# EAGLE design BabyDriver (EAGLE 6.4)
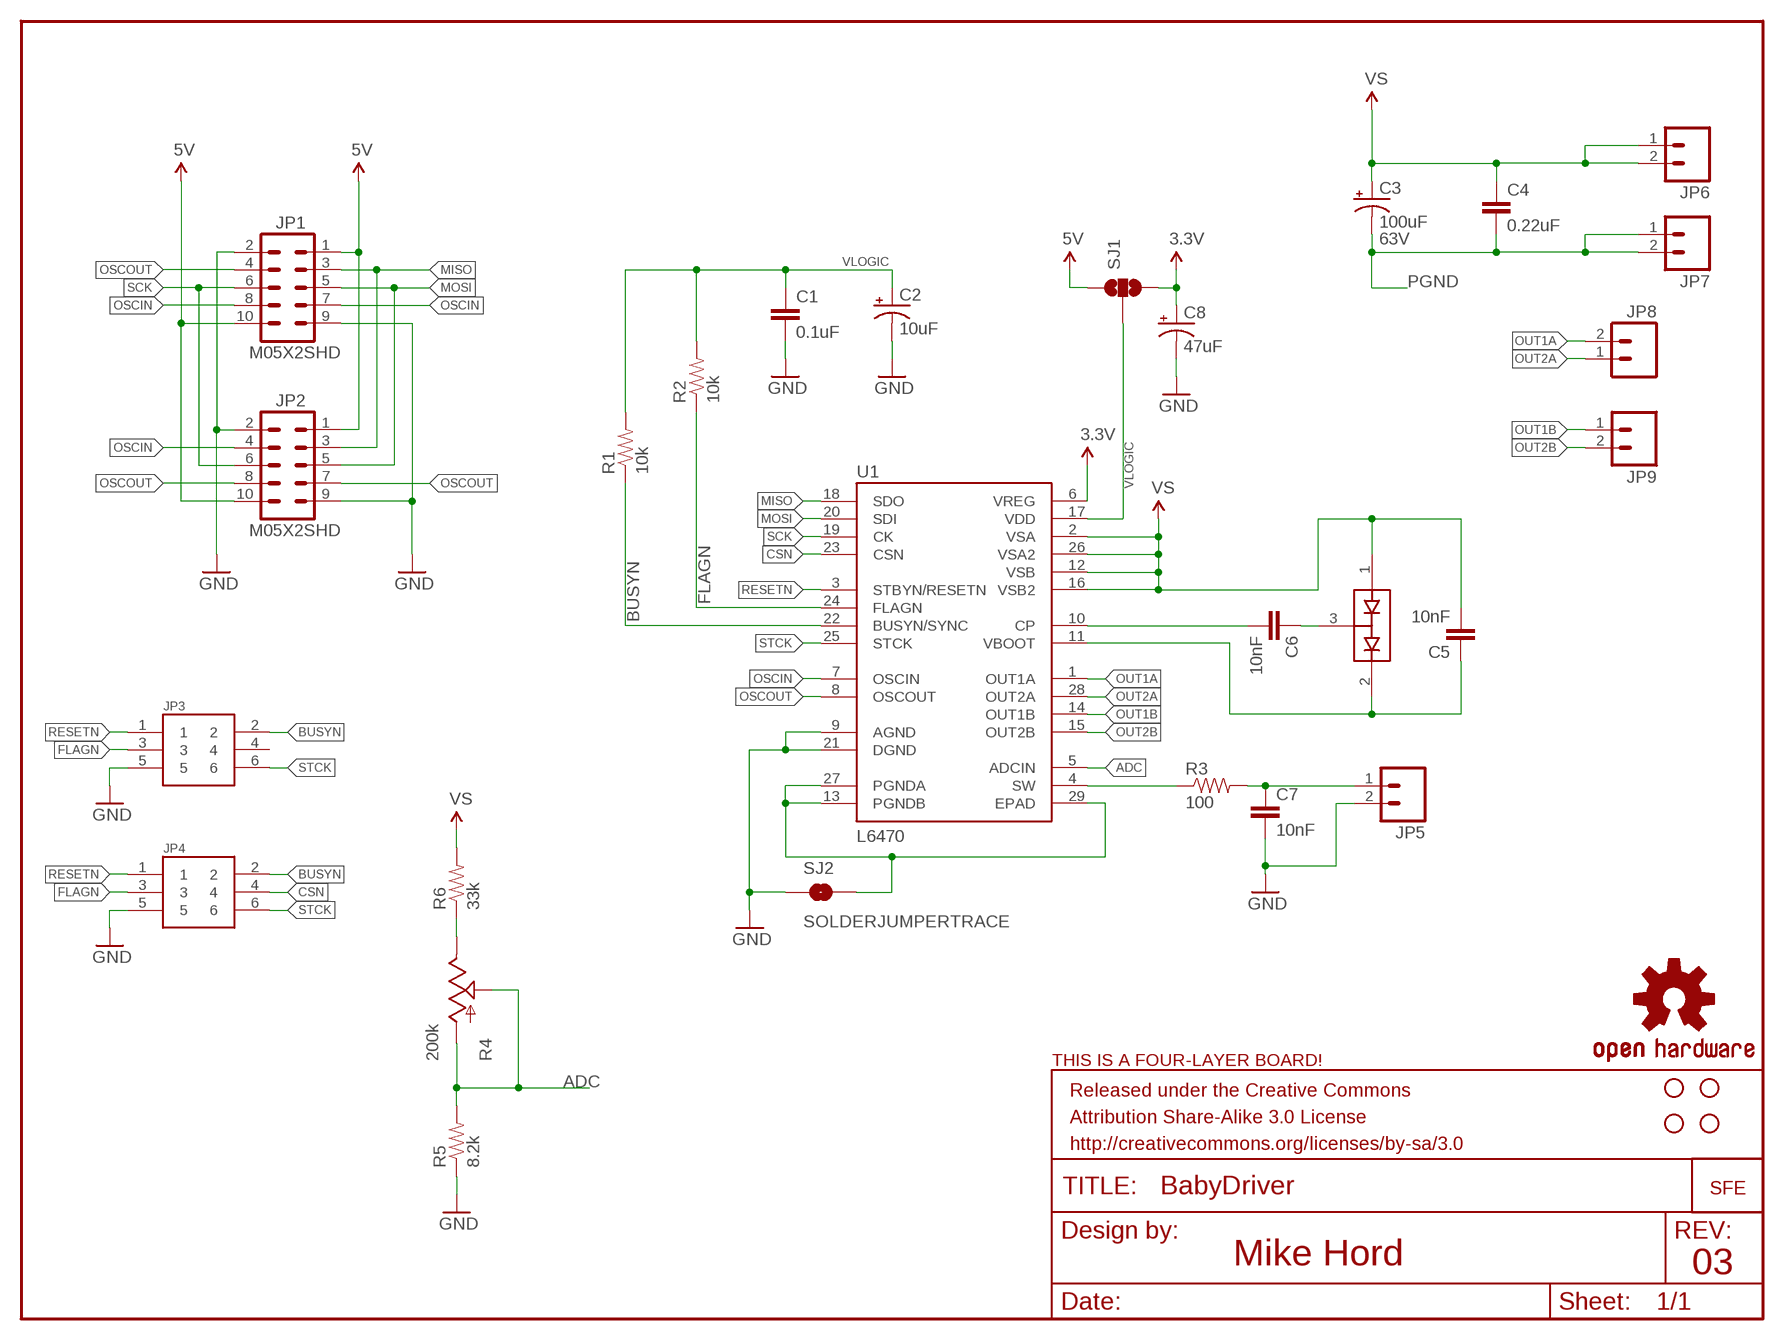
[diagram p0: schematic, sheet 1]

## Parts
C1  0.1uF  .1UF-CER  [0402-CAP]
C2  10uF  10UF-TANT  [EIA3216]
C3  100uF  100UF-ELECT  [PANASONIC_H13]
C4  0.22uF  .22UF-CER  [0402-CAP]
C5  10nF  10NF-CER  [0402-CAP]
C6  10nF  10NF-CER  [0402-CAP]
C7  10nF  10NF-CER  [0402-CAP]
C8  47uF  47UF-TANT  [EIA3528]
D1  BAV99  [SOT23]
FRAME1  FRAME-LETTER  [CREATIVE_COMMONS]
JP1  M05X2SHD  [2X5-SHROUDED]
JP2  M05X2SHD  [2X5-SHROUDED]
JP3  M03X2  [2X3-SHROUDED]
JP4  M03X2  [2X3-SHROUDED]
JP5  M023.5MM  [SCREWTERMINAL-3.5MM-2]
JP6  M023.5MM  [SCREWTERMINAL-3.5MM-2]
JP7  M023.5MM  [SCREWTERMINAL-3.5MM-2]
JP8  M023.5MM  [SCREWTERMINAL-3.5MM-2]
JP9  M023.5MM  [SCREWTERMINAL-3.5MM-2]
LOGO1  OSHW-LOGOS  [OSHW-LOGO-S]
LOGO2  LOGO-SFENEW  [SFE-NEW-WEBLOGO]
R1  10k  10K-1%RES-00824  [0402-RES]
R2  10k  10K-1%RES-00824  [0402-RES]
R3  100  100-1%  [0402-RES]
R4  200k  POT100K_3362U  [3362U]
R5  8.2k  8.2K-5%  [0402-RES]
R6  33k  33K-1%  [0402-RES]
SJ1  SOLDERJUMPER_2WAYPASTE1&2  [SJ_3_PASTE1&2]
SJ2  SOLDERJUMPERTRACE  [SJ_2S-TRACE]
STANDOFF1  STAND-OFF  [STAND-OFF]
STANDOFF2  STAND-OFF  [STAND-OFF]
STANDOFF3  STAND-OFF  [STAND-OFF]
STANDOFF4  STAND-OFF  [STAND-OFF]
U1  L6470  L6470  [HTSSOP28]
U$4  FOUR_LAYER_WARNING  [FOUR_LAYER_WARNING]

## Nets
3.3V: C8.A(+) SJ1.3 U1.6(VREG)
5V: JP1.1 JP1.10 JP2.1 JP2.10 SJ1.1
ADC: R4.P$2(S) R4.P$3(A) R5.2 U1.5(ADCIN)
BUSYN: JP3.2 JP4.2 R1.1 U1.22(BUSYN/SYNC)
CSN: JP4.4 U1.23(CSN)
FLAGN: JP3.3 JP4.3 R2.1 U1.24(FLAGN)
GND: C1.2 C2.C(-) C7.2 C8.C(-) JP1.2 JP1.9 JP2.2 JP2.9 JP3.5 JP4.5 JP5.2 R5.1 SJ2.1 U1.9(AGND) U1.21(DGND)
MISO: JP1.3 JP2.3 U1.18(SDO)
MOSI: JP1.5 JP2.5 U1.20(SDI)
N$5: R3.1 U1.4(SW)
N$6: C7.1 JP5.1 R3.2
N$7: C6.2 U1.10(CP)
N$8: C6.1 D1.3(COM)
N$9: C5.1 D1.2(C2) U1.11(VBOOT)
N$11: R4.P$1(E) R6.1
OSCIN: JP1.7 JP1.8 JP2.4 U1.7(OSCIN)
OSCOUT: JP1.4 JP2.7 JP2.8 U1.8(OSCOUT)
OUT1A: JP8.2 U1.1(OUT1A)
OUT1B: JP9.1 U1.14(OUT1B)
OUT2A: JP8.1 U1.28(OUT2A)
OUT2B: JP9.2 U1.15(OUT2B)
PGND: C3.- C4.2 JP7.1 JP7.2 SJ2.2 U1.13(PGNDB) U1.27(PGNDA) U1.29(EPAD)
RESETN: JP3.1 JP4.1 U1.3(STBYN/RESETN)
SCK: JP1.6 JP2.6 U1.19(CK)
STCK: JP3.6 JP4.6 U1.25(STCK)
VLOGIC: C1.1 C2.A(+) R1.2 R2.2 SJ1.2 U1.17(VDD)
VS: C3.+ C4.1 C5.2 D1.1(A1) JP6.1 JP6.2 R6.2 U1.2(VSA) U1.12(VSB) U1.16(VSB2) U1.26(VSA2)
Unconnected: JP3.4

## Notes on the sheet
- 63V
- Mike Hord | 03

## Library data of the parts
C1 = SparkFun-Capacitors:.1UF-CER: .1uF ceramic SMT CAP-00810- 25V +80%/-20% (0603) CAP-08390- 100V 10% (0603) CAP-08604- 25V 5% (0603); PROD_ID: CAP-00810
C2 = SparkFun-Capacitors:10UF-TANT: 10uF Tantalum SMT CAP-00811- 16V 10% (EIA-3216); PROD_ID: CAP-00811
C3 = SparkFun-Capacitors:100UF-ELECT: 100uF electrolytic SMT CAP-08362- 63V 20%; PROD_ID: CAP-08362
C4 = SparkFun-Capacitors:.22UF-CER: .22uF ceramic SMT CAP-09885- 50V +80%/-20% (0603); PROD_ID: CAP-09885; VALUE: .22uF
C5-C7 = SparkFun-Capacitors:10NF-CER: 10nF/.01uF/10000pF ceramic SMT CAP-00867- 50V 10% (0603); PROD_ID: CAP-00867
C8 = SparkFun-Capacitors:47UF-TANT: 47uF Tantalum SMT CAP-08310- 10V 10% (EIA-3528); PROD_ID: CAP-08310
D1 = SparkFun-DiscreteSemi:BAV99: Two small signal silicon diodes connected anode to cathode. Connections to all three nodes available. DIO-10647; PROD_ID: DIO-10647
FRAME1 = SparkFun-Aesthetics:FRAME-LETTER: Schematic Frame Standard 8.5x11 US Letter frame
JP1 JP2 = SparkFun-Connectors:M05X2: Header 5x2 Standard 10-pin dual row 0.1" header. Commonly used with AVR-ISP. Use with Spark Fun Electronics SKU: PRT-00778
JP3 JP4 = SparkFun-Connectors:M03X2: Shrouded 2x3 .1" header, with keying.
JP5-JP9 = SparkFun:M02: Header 2 Standard 2-pin 0.1" header. Use with straight break away headers (SKU : PRT-00116), right angle break away headers (PRT-00553), swiss pins (PRT-00743), machine pins (PRT-00117), and female headers (PRT-00115). Molex polarized connector foot print use with SKU : PRT-08233 with associated crimp pins and housings.
LOGO1 = SparkFun:OSHW-LOGO: Open Source Hardware Logo This logo indicates the piece of hardware it is found on incorporates a OSHW license and/or adheres to the definition of open source hardware found here: http://freedomdefined.org/OSHW
LOGO2 = SparkFun:LOGO-SFE: Spark Fun Electronics PCB Logo This is the standard Spark Fun Electronics PCB logo.
R1 R2 = SparkFun-Resistors:10K-1%: 10k-ohm SMT 1/10W - 1% (0603) RES-00824; PROD_ID: RES-00824
R3 = SparkFun-Resistors:100-1%: 100-ohm SMT 1/10W - 1% (0603) RES-07863; PROD_ID: RES-07863
R4 = SparkFun:POT
R5 = SparkFun-Resistors:8.2K-5%: 8.2k-ohm SMT 1/10W - 5% (0603) RES-10646; PROD_ID: RES-10646
R6 = SparkFun-Resistors:33K-1%: 33k-ohm SMT 1/10W - 1% (0603) RES-08416; PROD_ID: RES-08416
SJ1 = SparkFun-Passives:SOLDERJUMPER_2WAY: Solder Jumper 2 way solder jumper
SJ2 = SparkFun-Passives:SOLDERJUMPER: Solder Jumper Standard SMD solder jumper. Used to automate production. Two varients : Normally Open and Normally Closed are the same, but have different paste layers. NC will have a large amount of paste and should jumper during reflow.
STANDOFF1-STANDOFF4 = SparkFun:STAND-OFF: Stand Off This is the mechanical footprint for a #4 phillips button head screw. Use the keepout ring to avoid running the screw head into surrounding components. SKU : PRT-00447
U1 = SparkFun-PowerIC:L6470: 3A RMS/7A peak bipolar stepper motor driver with SPI control and step input in HTSSOP-28 package. IC-10648; PROD_ID: IC-10648
U$4 = SparkFun-Aesthetics:FOUR_LAYER_WARNING: Warning text which will appear on both the schematic and the board file, notifying viewers that the design is a four-layer PCB.

## Board
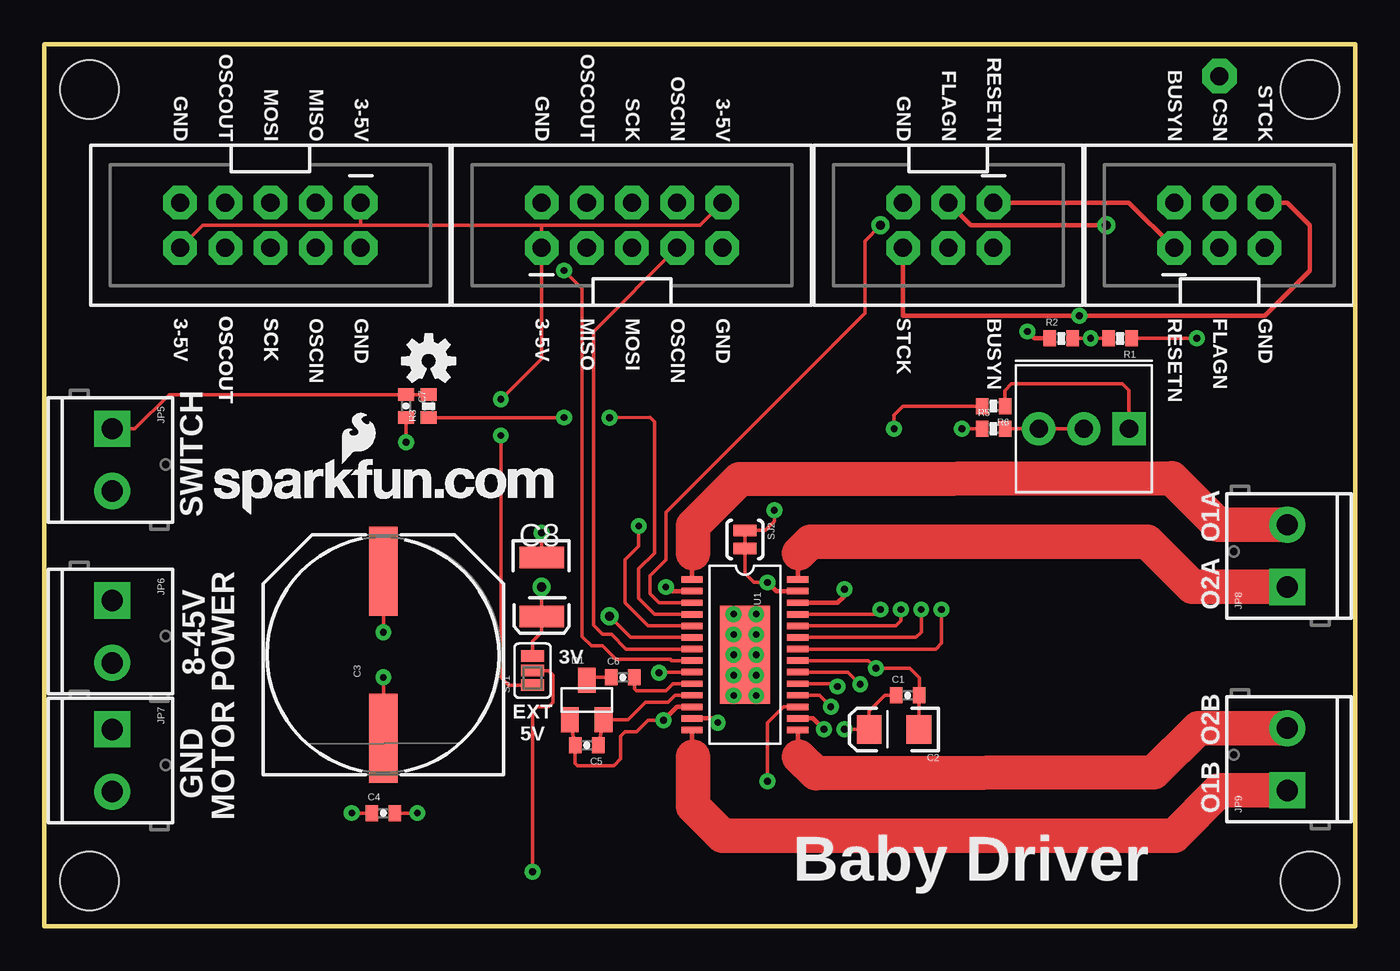
[diagram p1: board, top side]
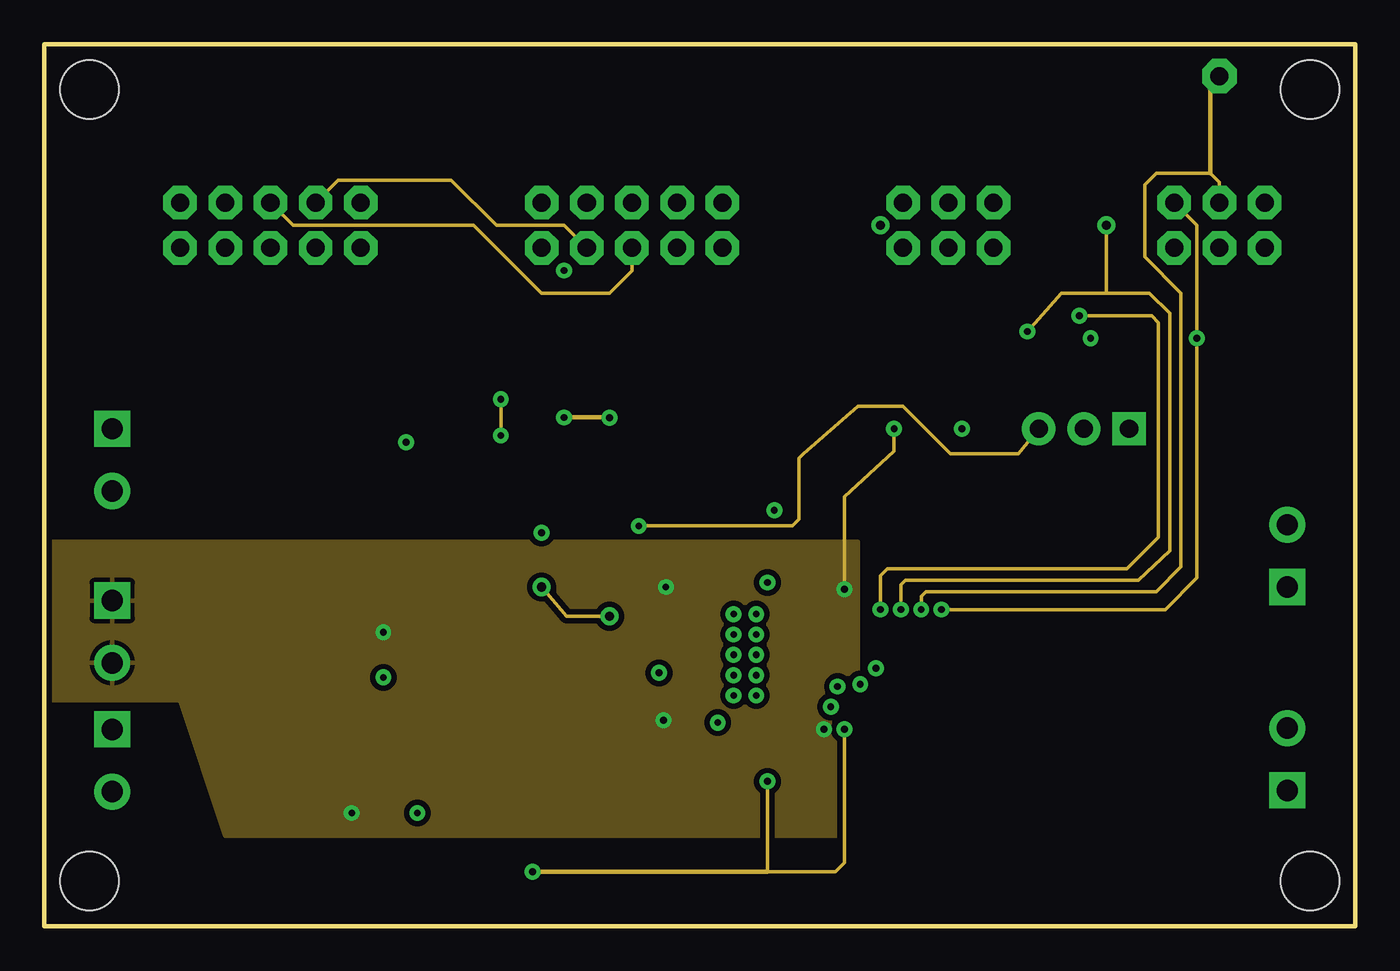
[diagram p2: board, inner layer Route2]
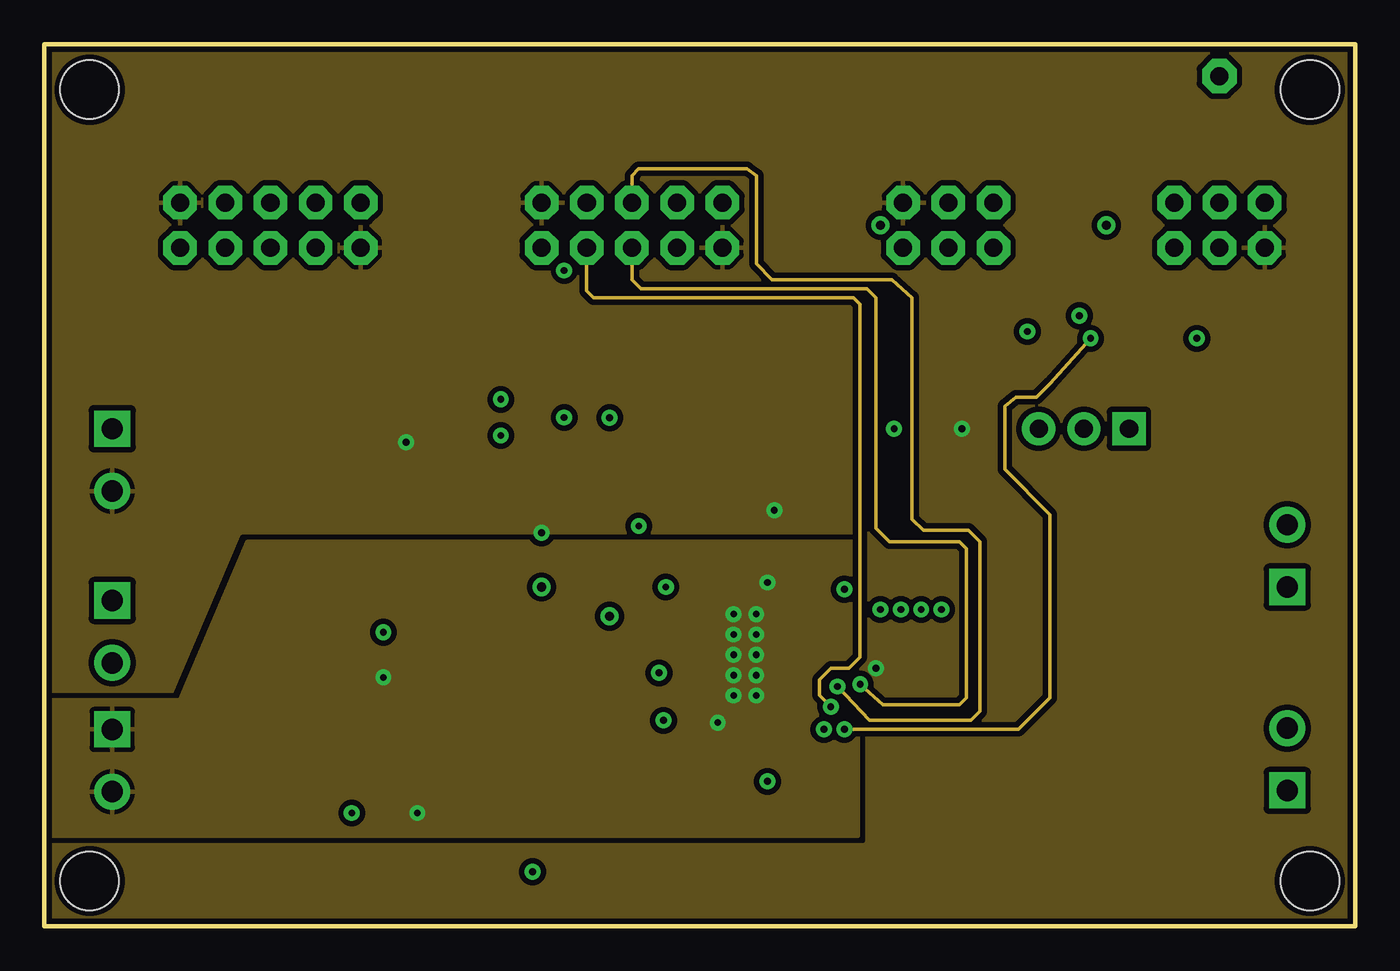
[diagram p3: board, inner layer Route15]
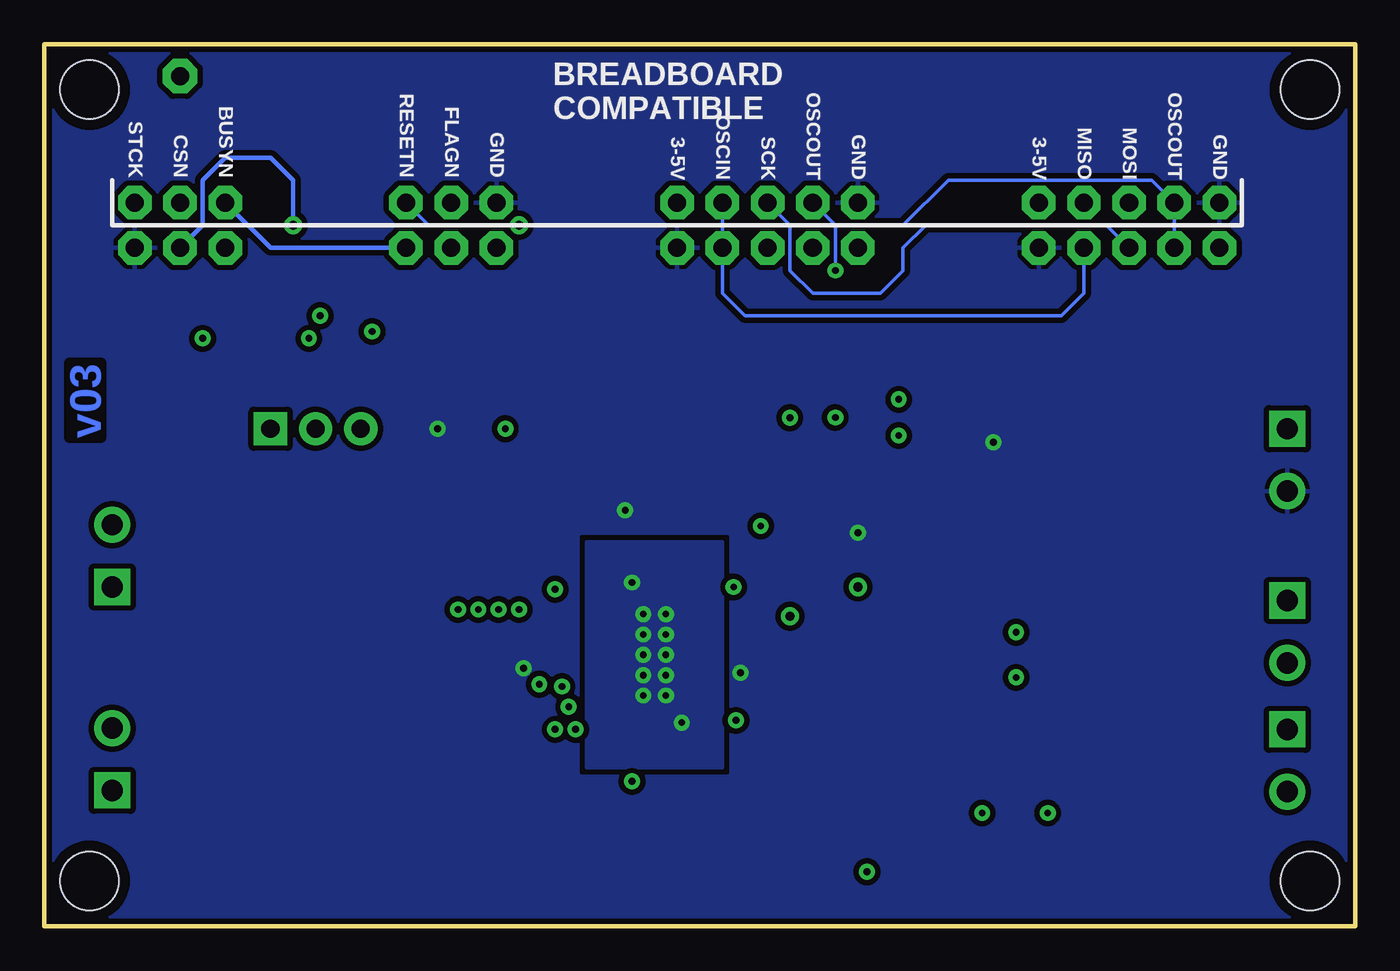
[diagram p4: board, bottom side, seen from below]

Size 73.66 x 49.53 mm. Coordinates in mm from the lower left corner, seen from the top.
Outline: 0,0 73.66,0 73.66,49.53 0,49.53 0,0
Copper layers (1*2*15*16): Top 0.035mm / dielectric 1.5mm / Route2 0.035mm / dielectric 0.15mm / Route15 0.035mm / dielectric 0.2mm / Bottom 0.035mm
Design rules "default": minimum track width 8mil, minimum drill 15mil, track to track 8mil, track to pad 8mil, pad to pad 8mil, via to via 8mil, smd to smd 8mil, copper to edge 8mil, drill to drill 8mil, minimum pad ring 12mil, minimum via ring 10mil, stop-mask expansion 4mil, vias tented up to drill 20mil, thermal gap 10mil

### Footprints (pad centres in the part's own frame; a part is rotated, then mirrored left to right if it is on the bottom)
0402-CAP = smd 0.7 x 0.9: 1 -0.65,0; 2 0.65,0
EIA3216 = smd 1.4 x 1.6: A 1.4,0; C -1.4,0
PANASONIC_H13 = smd 5 x 1.6: + 4.7,0; - -4.7,0
EIA3528 = smd 1.2 x 2.5: A 1.65,0; C -1.65,0
SOT23 = smd 1 x 1.4: 1 -0.95,-1.1; 2 0.95,-1.1; 3 0,1.1
2X5-SHROUDED = drill 1.016 pad 1.88 octagon: 1 -1.27,5.08; 2 1.27,5.08; 3 -1.27,2.54; 4 1.27,2.54; 5 -1.27,0; 6 1.27,0; 7 -1.27,-2.54; 8 1.27,-2.54; 9 -1.27,-5.08; 10 1.27,-5.08
2X3-SHROUDED = drill 1.016 pad 1.88 octagon: 1 -1.27,2.54; 2 1.27,2.54; 3 -1.27,0; 4 1.27,0; 5 -1.27,-2.54; 6 1.27,-2.54
SCREWTERMINAL-3.5MM-2 = drill 1.2 pad 2.032 square: 1 0,0 | drill 1.2 pad 2.032: 2 3.5,0
0402-RES = smd 0.7 x 0.9: 1 -0.65,0; 2 0.65,0
3362U = drill 1.016 pad 1.88 square: P$1 0,2.54 | drill 1.016 pad 1.88: P$2 2.54,2.54; P$3 5.08,2.54
SJ_3_PASTE1&2 = smd 0.635 x 1.27: 1 -0.813,0; 2 0,0; 3 0.813,0
SJ_2S-TRACE = smd 0.635 x 1.27: 1 -0.508,0; 2 0.508,0
STAND-OFF = hole 3.302: 0,0
HTSSOP28 = smd 0.36 x 1.19: 1 -4.225,-2.97; 2 -3.575,-2.97; 3 -2.925,-2.97; 4 -2.275,-2.97; 5 -1.625,-2.97; 6 -0.975,-2.97; 7 -0.325,-2.97; 8 0.325,-2.97; 9 0.975,-2.97; 10 1.625,-2.97; 11 2.275,-2.97; 12 2.925,-2.97; 13 3.575,-2.97; 14 4.225,-2.97; 15 4.225,2.97; 16 3.575,2.97; 17 2.925,2.97; 18 2.275,2.97; 19 1.625,2.97; 20 0.975,2.97; 21 0.325,2.97; 22 -0.325,2.97; 23 -0.975,2.97; 24 -1.625,2.97; 25 -2.275,2.97; 26 -2.925,2.97; 27 -3.575,2.97; 28 -4.225,2.97 | smd 5.5 x 2.8: 29 0,0

### Placement (x,y rotation side)
C1  48.51,12.95 0 top
C2  47.75,11.05 180 top
C3  19.05,15.24 90 top
C4  19.05,6.35 0 top
C5  30.48,10.16 180 top
C6  32.51,13.97 0 top
C7  20.32,29.21 270 top
C8  27.94,19.05 270 top
D1  30.48,12.7 0 top
FRAME1  11.43,-11.43 0 top  (outside the outline)
JP1  33.02,39.37 90 top
JP2  12.7,39.37 270 top
JP3  50.8,39.37 270 top
JP4  66.04,39.37 90 top
JP5  3.81,27.94 270 top
JP6  3.81,18.29 270 top
JP7  3.81,11.05 270 top
JP8  69.85,19.05 90 top
JP9  69.85,7.62 90 top
LOGO1  21.59,31.75 0 top
LOGO2  9.53,23.11 0 top
R1  60.45,33.02 180 top
R2  57.15,33.02 0 top
R3  21.59,29.21 90 top
R4  60.96,30.48 180 top
R5  53.34,27.94 0 top
R6  53.34,29.21 180 top
SJ1  27.43,14.35 90 top
SJ2  39.37,21.72 270 top
STANDOFF1  71.12,46.99 0 top
STANDOFF2  71.12,2.54 0 top
STANDOFF3  2.54,2.54 0 top
STANDOFF4  2.54,46.99 0 top
U1  39.37,15.24 270 top
U$4  0,-2.54 0 top

### Tracks (layer width: path | path; a pad name or v marks a point on that pad's centre or on a via)
3.3V  (via drill 0.51)
  Top 0.203: U1.6 32.93,16.21 v31.75,17.4 | v27.94,19.05 C8.A 27.94,16.51 27.43,16 SJ1.3
  Route2 0.203: v27.94,19.05 29.34,17.4 v31.75,17.4
5V  (via drill 0.38)
  Top 0.203: SJ1.1 26.09,13.54 25.65,13.97 v25.65,27.56 | v25.65,29.59 27.94,31.88 JP1.1 27.94,39.37 | JP1.10 36.83,39.37 27.94,39.37 | 27.94,39.37 17.78,39.37 | 17.78,39.37 8.89,39.37 JP2.10 | JP2.1 17.78,39.37
  Route2 0.203: v25.65,27.56 v25.65,29.59
ADC  (via drill 0.38)
  Top 0.203: U1.5 33.94,16.86 32.64,18.16 32.64,20.57 33.4,21.34 v33.4,22.48 | R5.2 R4.P$3 R4.P$2
  Route2 0.203: v33.4,22.48 42.04,22.48 42.42,22.86 42.42,26.29 42.67,26.54 45.72,29.21 48.26,29.21 50.93,26.54 54.74,26.54 R4.P$3
BUSYN  (via drill 0.38)
  Top 0.203: U1.22 50.11,15.56 50.42,15.88 v50.42,17.78 | R1.1 v64.77,33.02
  Route2 0.203: v50.42,17.78 62.99,17.78 64.77,19.56 v64.77,33.02 64.77,39.37 JP4.2
  Bottom 0.254: JP3.2 60.96,38.1 JP4.2
CSN  (via drill 0.38, 1.02 pad 1.93)
  Top 0.203: U1.23 48.98,16.21 49.28,16.51 v49.28,17.78
  Route2 0.203: v49.28,17.78 49.28,18.54 49.53,18.8 62.48,18.8 63.88,20.19 63.88,35.56 61.85,37.59 61.85,41.66 62.48,42.29 65.53,42.29 66.04,41.78 JP4.4
  Route2 0.254: 65.53,42.29 65.53,47.24 v66.04,47.75
FLAGN  (via drill 0.38, 0.51)
  Top 0.203: U1.24 47.85,16.86 48.13,17.14 v48.13,17.78
  Top 0.254: JP3.3 52.07,39.37 v59.69,39.37 | R2.1 55.63,33.02 v55.24,33.4
  Route2 0.203: v48.13,17.78 48.13,19.18 48.39,19.43 61.47,19.43 63.25,21.08 63.25,34.42 62.1,35.56 59.69,35.56 | v55.24,33.4 57.15,35.56 59.69,35.56 | v59.69,39.37 59.69,35.56
  Bottom 0.254: v59.69,39.37 59.69,41.91 60.96,43.18 63.5,43.18 64.77,41.91 64.77,39.37 JP4.3
GND  (via drill 0.38)
  Top 0.203: SJ2.1 40.51,22.23 41.02,22.73 v41.02,23.37 | U1.21 46.3,14.91 v46.74,14.48 48.64,14.48 49.16,13.96 C1.2 C2.C | R5.1 v51.56,27.94 | U1.9 34.59,14.27 v34.54,14.22 | C8.C v27.94,22.1 | C7.2 v20.32,27.18
  pour Route15 (isolate 0.305, rank 2): 0,49.53 73.66,49.53 73.66,-3.81 0,-3.81
  pour Bottom (isolate 0.305, rank 2): 0,49.53 73.66,49.53 73.66,0 0,0
MISO  (via drill 0.38)
  Top 0.203: U1.18 43.55,12.96 v44.2,12.32
  Route2 0.203: JP2.3 16.51,41.91 22.86,41.91 25.4,39.37 29.21,39.37 JP1.3
  Route15 0.203: v44.2,12.32 43.56,12.95 43.56,13.84 44.2,14.48 45.21,14.48 45.85,15.11 45.85,34.92 45.47,35.31 30.86,35.31 30.48,35.69 JP1.3
MOSI  (via drill 0.38)
  Top 0.203: U1.20 45.17,14.27 v45.85,13.59
  Route2 0.203: JP2.5 13.97,39.37 24.13,39.37 27.94,35.56 31.75,35.56 33.02,36.83 JP1.5
  Route15 0.203: v45.85,13.59 47.12,12.45 51.44,12.45 51.82,12.83 51.82,21.21 51.44,21.59 47.5,21.59 46.74,22.35 46.74,35.31 46.23,35.81 33.53,35.81 33.02,36.32 JP1.5
N$5  (via drill 0.38)
  Top 0.203: U1.4 34.3,17.52 33.4,18.41 33.4,20.07 34.29,20.95 34.29,28.32 34.04,28.57 v31.77,28.56 | R3.1 29.2,28.56 v29.21,28.57
  Route2 0.254: v29.21,28.57 31.75,28.57 v31.77,28.56
N$6
  Top 0.203: JP5.1 5.08,27.94 7,29.86 C7.1 R3.2
N$7
  Top 0.203: C6.2 33.16,13.32 33.27,13.21 34.92,13.21 35.33,13.62 U1.10
N$8
  Top 0.203: C6.1 30.65,13.97 D1.3
N$9
  Top 0.203: U1.11 35.44,12.96 35.05,12.57 33.78,12.57 32.81,11.6 D1.2 C5.1
N$11
  Top 0.203: R6.1 53.99,30.08 54.36,30.48 60.58,30.48 60.96,30.1 R4.P$1
OSCIN
  Top 0.203: U1.7 32.7,15.56 31.88,16.38 31.37,16.38 30.86,16.89 30.86,33.4 JP1.7
  Bottom 0.203: JP2.4 15.24,35.56 16.51,34.29 34.29,34.29 35.56,35.56 JP1.7 JP1.8
OSCOUT  (via drill 0.38)
  Top 0.203: U1.8 35.25,14.91 35.18,14.99 32.13,14.99 31.37,15.75 30.73,15.75 30.23,16.26 30.23,35.81 v29.21,36.83
  Bottom 0.203: JP2.8 JP2.7 11.43,41.91 22.86,41.91 25.4,39.37 29.21,39.37 | 29.21,39.37 JP1.4 | v29.21,36.83 29.21,39.37
OUT1A
  Top 0.254: U1.1 36.4,20.91 36.45,20.95
  Top 1.93: JP8.2 65.97,22.55 63.37,25.15 39.06,25.09 36.45,22.48 36.45,20.95
OUT1B
  Top 0.254: U1.14 36.4,9.57 36.45,9.53
  Top 1.93: JP9.1 66.04,7.62 63.5,5.08 38.1,5.08 36.45,6.73 36.45,9.53
OUT2A
  Top 0.254: U1.28 42.34,20.88 42.42,20.95
  Top 1.93: JP8.1 64.52,19.05 61.98,21.59 43.05,21.59 42.42,20.95
OUT2B
  Top 0.254: U1.15 42.34,9.6 42.42,9.53
  Top 1.93: JP9.2 64.84,11.12 62.36,8.64 43.36,8.58 42.42,9.53
PGND  (via drill 0.38)
  Top 0.203: v40.64,19.3 39.88,19.3 39.37,19.81 SJ2.2 | U1.29 v40.01,15.24 | C4.2 v20.95,6.35 | C3.- v19.05,13.97
  Top 0.254: U1.27 41.13,18.82 v40.64,19.3 | U1.13 37.61,11.66 v37.85,11.43
  other vias: 40.01,12.95 38.73,12.95 40.01,14.1 38.73,14.1 38.73,15.24 40.01,16.38 38.73,16.38 40.01,17.53 38.73,17.53
  pour Route15 (isolate 0.305): 0,5.08 45.72,5.08 45.72,21.59 11.43,21.59 7.62,12.7 0,12.7
  pour Bottom (isolate 0.305): 35.56,8.89 35.56,21.59 43.18,21.59 43.18,8.89
RESETN  (via drill 0.51)
  Top 0.203: U1.3 34.54,18.16 34.04,18.67 34.04,19.68 34.92,20.57 34.92,23.24 46.1,34.42 46.1,38.48 v46.99,39.37
  Top 0.254: JP3.1 60.96,40.64 JP4.1
  Bottom 0.203: v46.99,39.37 52.07,39.37 JP3.1
SCK  (via drill 0.38)
  Top 0.203: U1.19 44.42,13.62 v44.58,13.46
  Route15 0.203: v44.58,13.46 46.35,11.56 52.07,11.56 52.58,12.06 52.58,21.59 51.94,22.23 49.4,22.23 48.77,22.86 48.77,35.31 47.62,36.32 40.89,36.32 40.01,37.21 40.01,42.16 39.5,42.55 33.4,42.55 33.02,42.16 JP1.6
  Bottom 0.203: JP2.6 13.97,39.37 24.13,39.37 25.4,38.1 25.4,36.83 26.67,35.56 30.48,35.56 31.75,36.83 31.75,39.37 JP1.6
STCK  (via drill 0.38)
  Top 0.203: U1.25 46.73,17.52 v46.99,17.78
  Top 0.254: JP3.6 48.26,34.29 v58.17,34.29 68.58,34.29 71.12,36.83 71.12,39.37 69.85,40.64 JP4.6
  Route2 0.203: v46.99,17.78 46.99,19.68 47.37,20.07 60.83,20.07 62.61,21.84 62.61,33.91 62.23,34.29 v58.17,34.29
VLOGIC  (via drill 0.38)
  Top 0.203: v44.96,11.05 C2.A 46.35,12.06 47.24,12.95 C1.1 | U1.17 41.52,12.31 40.64,11.43 v40.64,8.13 | v27.43,3.05 27.43,12.06 27.69,12.32 28.32,12.32 28.57,12.57 28.57,14.1 28.32,14.35 SJ1.2 | R2.2 v58.8,33.02 R1.2
  Route2 0.203: v44.96,11.05 44.96,3.56 44.45,3.05 40.64,3.05 v40.64,8.13
  Route2 0.254: 40.64,3.05 v27.43,3.05
  Route15 0.203: v44.96,11.05 54.74,11.05 56.52,12.83 56.52,23.11 53.98,25.65 53.98,29.21 54.61,29.72 55.75,29.72 56.52,30.48 v58.8,33.02
VS  (via drill 0.38)
  Top 0.203: R6.2 48.26,29.21 47.75,28.7 v47.75,27.94 | D1.1 C5.2 29.83,9.16 29.97,9.02 32,9.02 32.38,9.4 32.38,10.67 32.64,10.92 33.27,10.92 33.91,11.56 v34.8,11.56 | C3.+ v19.05,16.51 | C4.1 v17.27,6.35
  Top 0.254: U1.26 44.58,18.16 44.96,18.54 v44.96,18.92 | U1.2 35.16,18.82 v34.92,19.05 | U1.16 43.2,11.66 v43.81,11.05 | U1.12 35.56,12.31 v34.8,11.56
  Route2 0.203: v47.75,27.94 47.75,26.67 44.96,24.13 v44.96,18.92
  pour Route2 (isolate 0.305, rank 3): 0,21.59 45.72,21.59 45.72,5.08 10.16,5.08 7.62,12.7 0,12.7

### Text on the board
Bottom: v03
tPlace: GND | OSCOUT | MOSI | MISO | 3-5V | GND | OSCOUT | SCK | OSCIN | 3-5V | GND | FLAGN | RESETN | BUSYN | CSN | STCK | 3-5V | OSCOUT | OSCOUT | SCK | SCK | OSCIN | GND | 3-5V | MISO | MOSI | OSCIN | GND | STCK | BUSYN | RESETN | FLAGN | GND | SWITCH | O1A | O2A | 8-45V | 3V | MOTOR POWER | EXT / 5V | O2B | GND | O1B | Baby Driver
bPlace: BREADBOARD / COMPATIBLE | GND | OSCOUT | MOSI | MISO | 3-5V | GND | OSCOUT | SCK | OSCIN | 3-5V | GND | FLAGN | RESETN | BUSYN | CSN | STCK
tValues: M.Hord